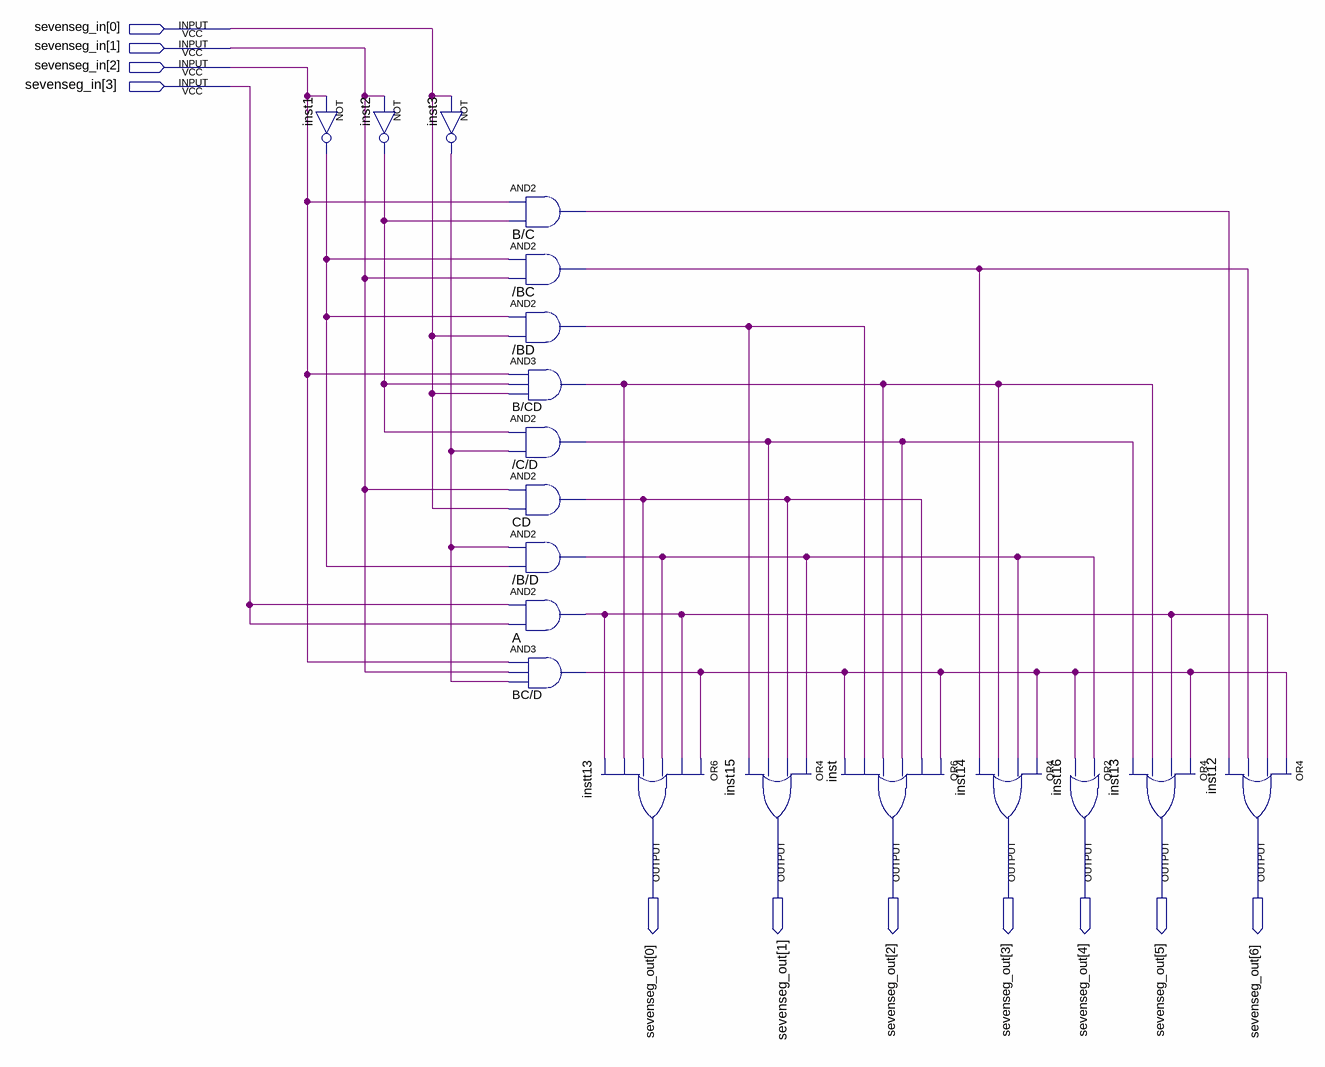
[diagram p0: schematic sheet]
// Quartus schematic sevenseg.bdf as structural Verilog: 19 symbols, 11 pins
module sevenseg (
  input  [3:0] sevenseg_in,
  output [6:0] sevenseg_out
);

  wire _B_D_out, _BC_out, _BD_out, _C_D_out, A_out, B_C_out, B_CD_out, BC_D_out, CD_out, inst1_out,
       inst2_out, inst3_out;

  not inst1 (inst1_out, sevenseg_in[2]);
  not inst2 (inst2_out, sevenseg_in[1]);
  not inst3 (inst3_out, sevenseg_in[0]);
  and \B/C  (B_C_out, sevenseg_in[2], inst2_out);
  and \u_/BC  (_BC_out, inst1_out, sevenseg_in[1]);
  and \u_/BD  (_BD_out, inst1_out, sevenseg_in[0]);
  and \B/CD  (B_CD_out, sevenseg_in[2], inst2_out, sevenseg_in[0]);
  and \u_/C/D  (_C_D_out, inst2_out, inst3_out);
  and CD (CD_out, sevenseg_in[1], sevenseg_in[0]);
  and \u_/B/D  (_B_D_out, inst3_out, inst1_out);
  and A (A_out, sevenseg_in[3], sevenseg_in[3]);
  and \BC/D  (BC_D_out, sevenseg_in[2], sevenseg_in[1], inst3_out);
  or instt13 (sevenseg_out[0], BC_D_out, A_out, _B_D_out, CD_out, B_CD_out, A_out);
  or inst15 (sevenseg_out[1], _B_D_out, CD_out, _C_D_out, _BD_out);
  or inst (sevenseg_out[2], BC_D_out, CD_out, _C_D_out, B_CD_out, _BD_out, BC_D_out);
  or inst14 (sevenseg_out[3], BC_D_out, _B_D_out, B_CD_out, _BC_out);
  or inst16 (sevenseg_out[4], _B_D_out, BC_D_out);
  or inst13 (sevenseg_out[5], BC_D_out, A_out, B_CD_out, _C_D_out);
  or inst12 (sevenseg_out[6], BC_D_out, A_out, _BC_out, B_C_out);
endmodule
